# Altium schematic sheet LED_Matrix16x16.SchDoc
size A3
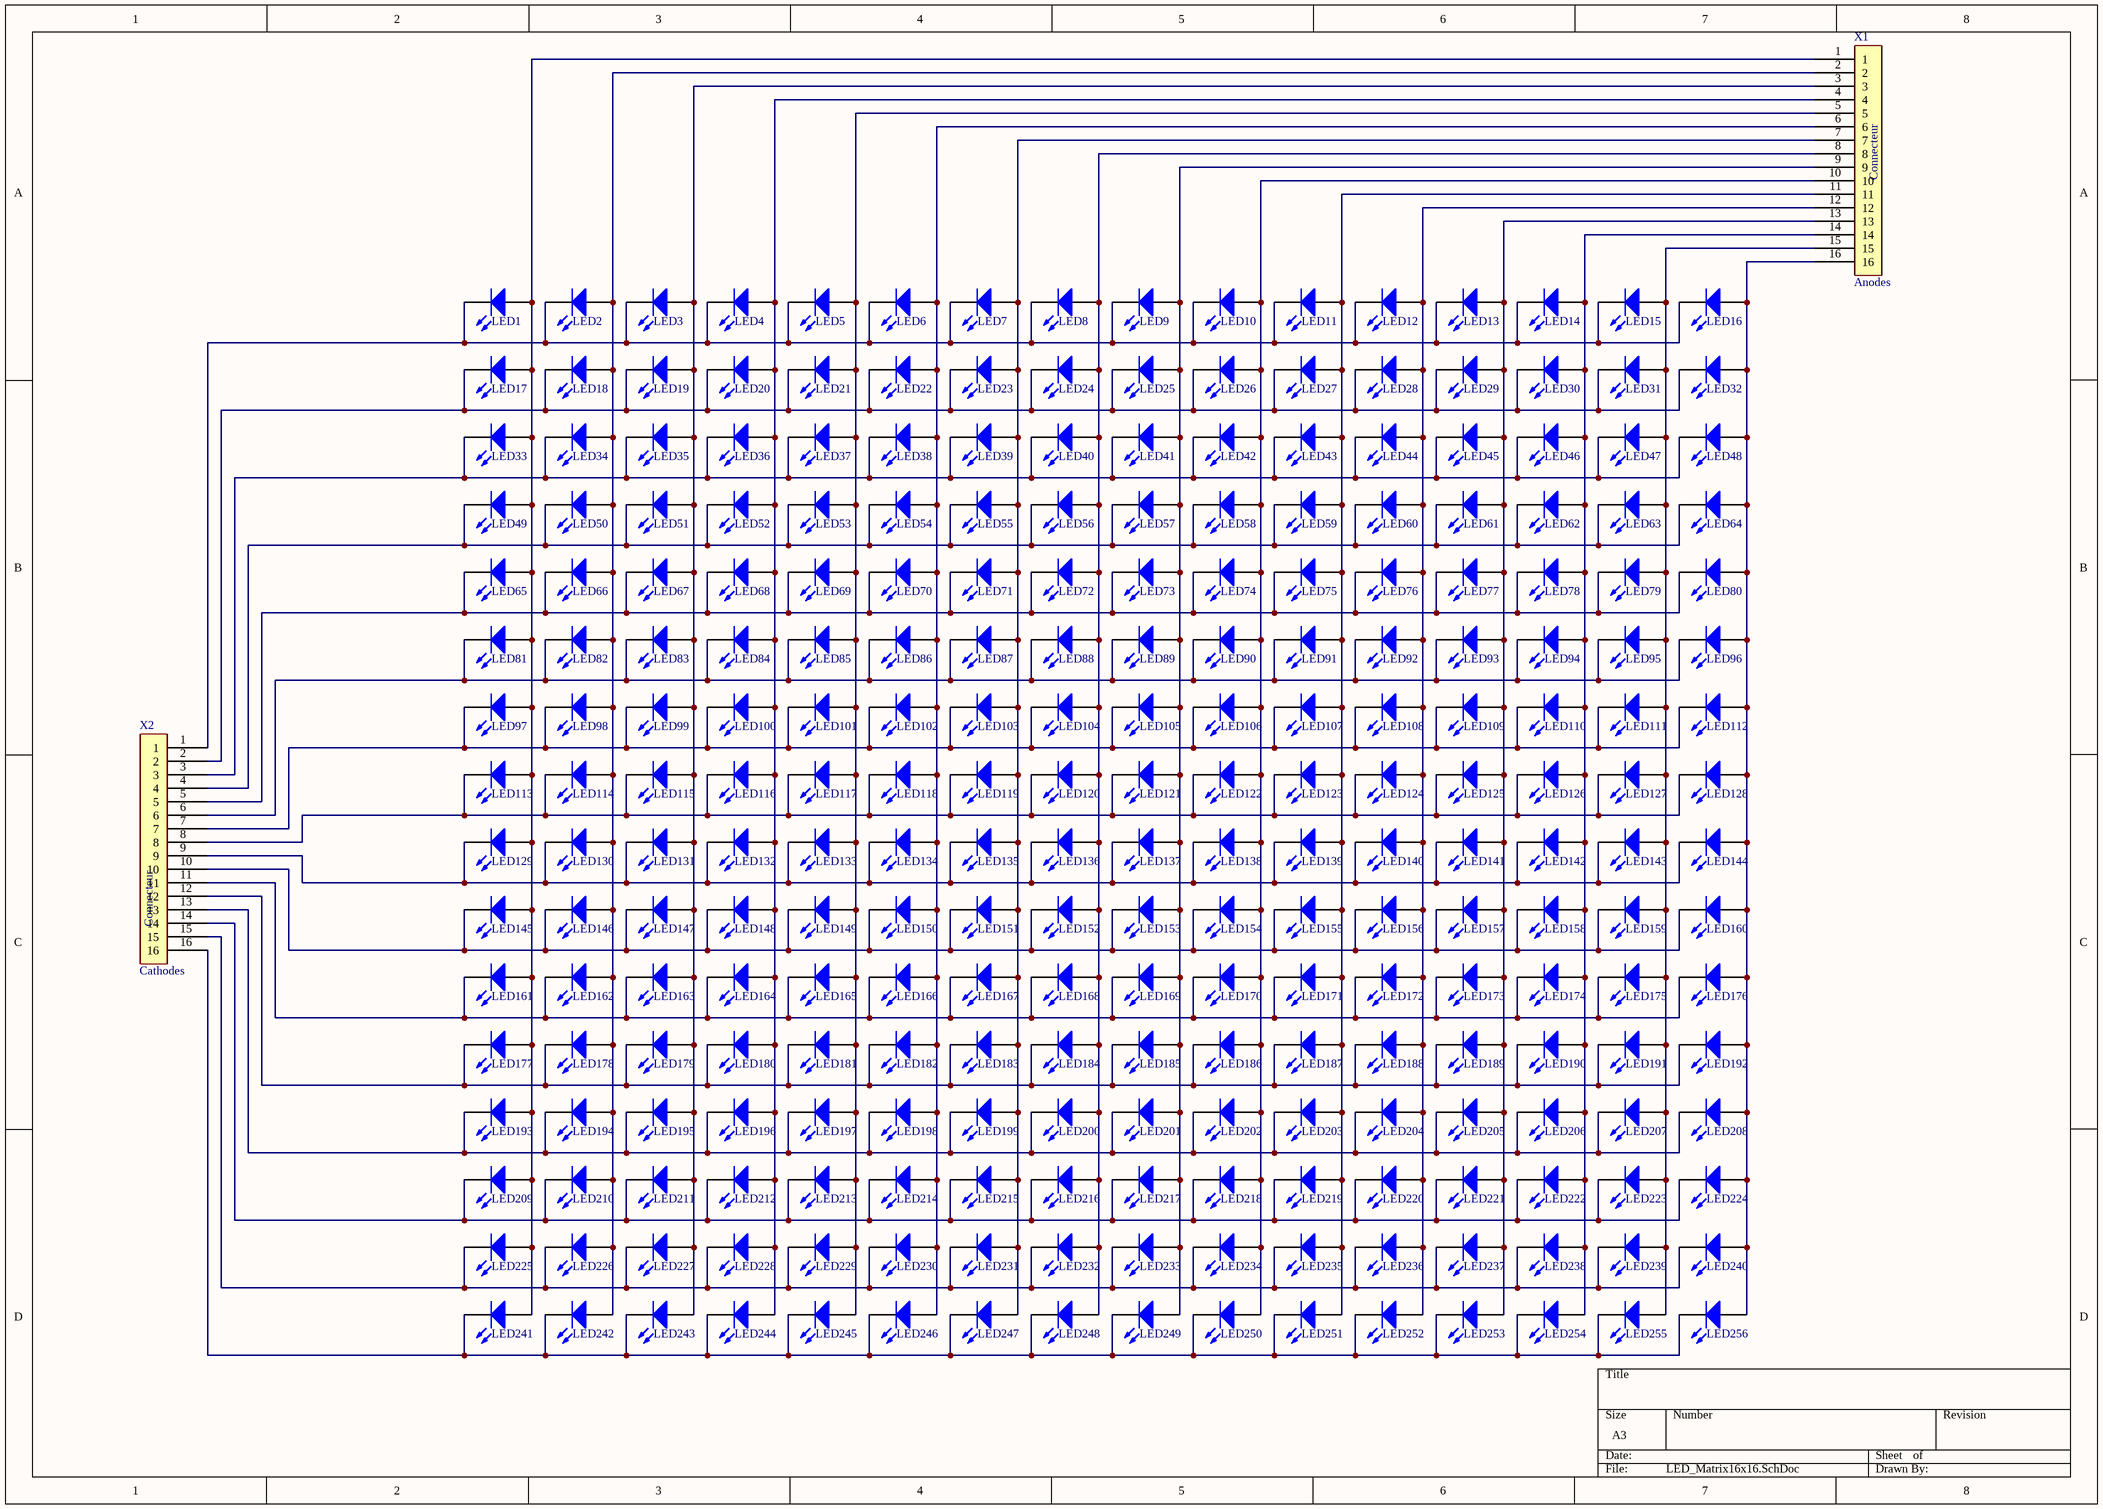
[diagram p0: LED_Matrix16x16.SchDoc]

## Parts
LED1  KPT-2012SRC-PRV  [0805_LED]  (value not drawn)
LED2  KPT-2012SRC-PRV  [0805_LED]  (value not drawn)
LED3  KPT-2012SRC-PRV  [0805_LED]  (value not drawn)
LED4  KPT-2012SRC-PRV  [0805_LED]  (value not drawn)
LED5  KPT-2012SRC-PRV  [0805_LED]  (value not drawn)
LED6  KPT-2012SRC-PRV  [0805_LED]  (value not drawn)
LED7  KPT-2012SRC-PRV  [0805_LED]  (value not drawn)
LED8  KPT-2012SRC-PRV  [0805_LED]  (value not drawn)
LED9  KPT-2012SRC-PRV  [0805_LED]  (value not drawn)
LED10  KPT-2012SRC-PRV  [0805_LED]  (value not drawn)
LED11  KPT-2012SRC-PRV  [0805_LED]  (value not drawn)
LED12  KPT-2012SRC-PRV  [0805_LED]  (value not drawn)
LED13  KPT-2012SRC-PRV  [0805_LED]  (value not drawn)
LED14  KPT-2012SRC-PRV  [0805_LED]  (value not drawn)
LED15  KPT-2012SRC-PRV  [0805_LED]  (value not drawn)
LED16  KPT-2012SRC-PRV  [0805_LED]  (value not drawn)
LED17  KPT-2012SRC-PRV  [0805_LED]  (value not drawn)
LED18  KPT-2012SRC-PRV  [0805_LED]  (value not drawn)
LED19  KPT-2012SRC-PRV  [0805_LED]  (value not drawn)
LED20  KPT-2012SRC-PRV  [0805_LED]  (value not drawn)
LED21  KPT-2012SRC-PRV  [0805_LED]  (value not drawn)
LED22  KPT-2012SRC-PRV  [0805_LED]  (value not drawn)
LED23  KPT-2012SRC-PRV  [0805_LED]  (value not drawn)
LED24  KPT-2012SRC-PRV  [0805_LED]  (value not drawn)
LED25  KPT-2012SRC-PRV  [0805_LED]  (value not drawn)
LED26  KPT-2012SRC-PRV  [0805_LED]  (value not drawn)
LED27  KPT-2012SRC-PRV  [0805_LED]  (value not drawn)
LED28  KPT-2012SRC-PRV  [0805_LED]  (value not drawn)
LED29  KPT-2012SRC-PRV  [0805_LED]  (value not drawn)
LED30  KPT-2012SRC-PRV  [0805_LED]  (value not drawn)
LED31  KPT-2012SRC-PRV  [0805_LED]  (value not drawn)
LED32  KPT-2012SRC-PRV  [0805_LED]  (value not drawn)
LED33  KPT-2012SRC-PRV  [0805_LED]  (value not drawn)
LED34  KPT-2012SRC-PRV  [0805_LED]  (value not drawn)
LED35  KPT-2012SRC-PRV  [0805_LED]  (value not drawn)
LED36  KPT-2012SRC-PRV  [0805_LED]  (value not drawn)
LED37  KPT-2012SRC-PRV  [0805_LED]  (value not drawn)
LED38  KPT-2012SRC-PRV  [0805_LED]  (value not drawn)
LED39  KPT-2012SRC-PRV  [0805_LED]  (value not drawn)
LED40  KPT-2012SRC-PRV  [0805_LED]  (value not drawn)
LED41  KPT-2012SRC-PRV  [0805_LED]  (value not drawn)
LED42  KPT-2012SRC-PRV  [0805_LED]  (value not drawn)
LED43  KPT-2012SRC-PRV  [0805_LED]  (value not drawn)
LED44  KPT-2012SRC-PRV  [0805_LED]  (value not drawn)
LED45  KPT-2012SRC-PRV  [0805_LED]  (value not drawn)
LED46  KPT-2012SRC-PRV  [0805_LED]  (value not drawn)
LED47  KPT-2012SRC-PRV  [0805_LED]  (value not drawn)
LED48  KPT-2012SRC-PRV  [0805_LED]  (value not drawn)
LED49  KPT-2012SRC-PRV  [0805_LED]  (value not drawn)
LED50  KPT-2012SRC-PRV  [0805_LED]  (value not drawn)
LED51  KPT-2012SRC-PRV  [0805_LED]  (value not drawn)
LED52  KPT-2012SRC-PRV  [0805_LED]  (value not drawn)
LED53  KPT-2012SRC-PRV  [0805_LED]  (value not drawn)
LED54  KPT-2012SRC-PRV  [0805_LED]  (value not drawn)
LED55  KPT-2012SRC-PRV  [0805_LED]  (value not drawn)
LED56  KPT-2012SRC-PRV  [0805_LED]  (value not drawn)
LED57  KPT-2012SRC-PRV  [0805_LED]  (value not drawn)
LED58  KPT-2012SRC-PRV  [0805_LED]  (value not drawn)
LED59  KPT-2012SRC-PRV  [0805_LED]  (value not drawn)
LED60  KPT-2012SRC-PRV  [0805_LED]  (value not drawn)
LED61  KPT-2012SRC-PRV  [0805_LED]  (value not drawn)
LED62  KPT-2012SRC-PRV  [0805_LED]  (value not drawn)
LED63  KPT-2012SRC-PRV  [0805_LED]  (value not drawn)
LED64  KPT-2012SRC-PRV  [0805_LED]  (value not drawn)
LED65  KPT-2012SRC-PRV  [0805_LED]  (value not drawn)
LED66  KPT-2012SRC-PRV  [0805_LED]  (value not drawn)
LED67  KPT-2012SRC-PRV  [0805_LED]  (value not drawn)
LED68  KPT-2012SRC-PRV  [0805_LED]  (value not drawn)
LED69  KPT-2012SRC-PRV  [0805_LED]  (value not drawn)
LED70  KPT-2012SRC-PRV  [0805_LED]  (value not drawn)
LED71  KPT-2012SRC-PRV  [0805_LED]  (value not drawn)
LED72  KPT-2012SRC-PRV  [0805_LED]  (value not drawn)
LED73  KPT-2012SRC-PRV  [0805_LED]  (value not drawn)
LED74  KPT-2012SRC-PRV  [0805_LED]  (value not drawn)
LED75  KPT-2012SRC-PRV  [0805_LED]  (value not drawn)
LED76  KPT-2012SRC-PRV  [0805_LED]  (value not drawn)
LED77  KPT-2012SRC-PRV  [0805_LED]  (value not drawn)
LED78  KPT-2012SRC-PRV  [0805_LED]  (value not drawn)
LED79  KPT-2012SRC-PRV  [0805_LED]  (value not drawn)
LED80  KPT-2012SRC-PRV  [0805_LED]  (value not drawn)
LED81  KPT-2012SRC-PRV  [0805_LED]  (value not drawn)
LED82  KPT-2012SRC-PRV  [0805_LED]  (value not drawn)
LED83  KPT-2012SRC-PRV  [0805_LED]  (value not drawn)
LED84  KPT-2012SRC-PRV  [0805_LED]  (value not drawn)
LED85  KPT-2012SRC-PRV  [0805_LED]  (value not drawn)
LED86  KPT-2012SRC-PRV  [0805_LED]  (value not drawn)
LED87  KPT-2012SRC-PRV  [0805_LED]  (value not drawn)
LED88  KPT-2012SRC-PRV  [0805_LED]  (value not drawn)
LED89  KPT-2012SRC-PRV  [0805_LED]  (value not drawn)
LED90  KPT-2012SRC-PRV  [0805_LED]  (value not drawn)
LED91  KPT-2012SRC-PRV  [0805_LED]  (value not drawn)
LED92  KPT-2012SRC-PRV  [0805_LED]  (value not drawn)
LED93  KPT-2012SRC-PRV  [0805_LED]  (value not drawn)
LED94  KPT-2012SRC-PRV  [0805_LED]  (value not drawn)
LED95  KPT-2012SRC-PRV  [0805_LED]  (value not drawn)
LED96  KPT-2012SRC-PRV  [0805_LED]  (value not drawn)
LED97  KPT-2012SRC-PRV  [0805_LED]  (value not drawn)
LED98  KPT-2012SRC-PRV  [0805_LED]  (value not drawn)
LED99  KPT-2012SRC-PRV  [0805_LED]  (value not drawn)
LED100  KPT-2012SRC-PRV  [0805_LED]  (value not drawn)
LED101  KPT-2012SRC-PRV  [0805_LED]  (value not drawn)
LED102  KPT-2012SRC-PRV  [0805_LED]  (value not drawn)
LED103  KPT-2012SRC-PRV  [0805_LED]  (value not drawn)
LED104  KPT-2012SRC-PRV  [0805_LED]  (value not drawn)
LED105  KPT-2012SRC-PRV  [0805_LED]  (value not drawn)
LED106  KPT-2012SRC-PRV  [0805_LED]  (value not drawn)
LED107  KPT-2012SRC-PRV  [0805_LED]  (value not drawn)
LED108  KPT-2012SRC-PRV  [0805_LED]  (value not drawn)
LED109  KPT-2012SRC-PRV  [0805_LED]  (value not drawn)
LED110  KPT-2012SRC-PRV  [0805_LED]  (value not drawn)
LED111  KPT-2012SRC-PRV  [0805_LED]  (value not drawn)
LED112  KPT-2012SRC-PRV  [0805_LED]  (value not drawn)
LED113  KPT-2012SRC-PRV  [0805_LED]  (value not drawn)
LED114  KPT-2012SRC-PRV  [0805_LED]  (value not drawn)
LED115  KPT-2012SRC-PRV  [0805_LED]  (value not drawn)
LED116  KPT-2012SRC-PRV  [0805_LED]  (value not drawn)
LED117  KPT-2012SRC-PRV  [0805_LED]  (value not drawn)
LED118  KPT-2012SRC-PRV  [0805_LED]  (value not drawn)
LED119  KPT-2012SRC-PRV  [0805_LED]  (value not drawn)
LED120  KPT-2012SRC-PRV  [0805_LED]  (value not drawn)
LED121  KPT-2012SRC-PRV  [0805_LED]  (value not drawn)
LED122  KPT-2012SRC-PRV  [0805_LED]  (value not drawn)
LED123  KPT-2012SRC-PRV  [0805_LED]  (value not drawn)
LED124  KPT-2012SRC-PRV  [0805_LED]  (value not drawn)
LED125  KPT-2012SRC-PRV  [0805_LED]  (value not drawn)
LED126  KPT-2012SRC-PRV  [0805_LED]  (value not drawn)
LED127  KPT-2012SRC-PRV  [0805_LED]  (value not drawn)
LED128  KPT-2012SRC-PRV  [0805_LED]  (value not drawn)
LED129  KPT-2012SRC-PRV  [0805_LED]  (value not drawn)
LED130  KPT-2012SRC-PRV  [0805_LED]  (value not drawn)
LED131  KPT-2012SRC-PRV  [0805_LED]  (value not drawn)
LED132  KPT-2012SRC-PRV  [0805_LED]  (value not drawn)
LED133  KPT-2012SRC-PRV  [0805_LED]  (value not drawn)
LED134  KPT-2012SRC-PRV  [0805_LED]  (value not drawn)
LED135  KPT-2012SRC-PRV  [0805_LED]  (value not drawn)
LED136  KPT-2012SRC-PRV  [0805_LED]  (value not drawn)
LED137  KPT-2012SRC-PRV  [0805_LED]  (value not drawn)
LED138  KPT-2012SRC-PRV  [0805_LED]  (value not drawn)
LED139  KPT-2012SRC-PRV  [0805_LED]  (value not drawn)
LED140  KPT-2012SRC-PRV  [0805_LED]  (value not drawn)
LED141  KPT-2012SRC-PRV  [0805_LED]  (value not drawn)
LED142  KPT-2012SRC-PRV  [0805_LED]  (value not drawn)
LED143  KPT-2012SRC-PRV  [0805_LED]  (value not drawn)
LED144  KPT-2012SRC-PRV  [0805_LED]  (value not drawn)
LED145  KPT-2012SRC-PRV  [0805_LED]  (value not drawn)
LED146  KPT-2012SRC-PRV  [0805_LED]  (value not drawn)
LED147  KPT-2012SRC-PRV  [0805_LED]  (value not drawn)
LED148  KPT-2012SRC-PRV  [0805_LED]  (value not drawn)
LED149  KPT-2012SRC-PRV  [0805_LED]  (value not drawn)
LED150  KPT-2012SRC-PRV  [0805_LED]  (value not drawn)
LED151  KPT-2012SRC-PRV  [0805_LED]  (value not drawn)
LED152  KPT-2012SRC-PRV  [0805_LED]  (value not drawn)
LED153  KPT-2012SRC-PRV  [0805_LED]  (value not drawn)
LED154  KPT-2012SRC-PRV  [0805_LED]  (value not drawn)
LED155  KPT-2012SRC-PRV  [0805_LED]  (value not drawn)
LED156  KPT-2012SRC-PRV  [0805_LED]  (value not drawn)
LED157  KPT-2012SRC-PRV  [0805_LED]  (value not drawn)
LED158  KPT-2012SRC-PRV  [0805_LED]  (value not drawn)
LED159  KPT-2012SRC-PRV  [0805_LED]  (value not drawn)
LED160  KPT-2012SRC-PRV  [0805_LED]  (value not drawn)
LED161  KPT-2012SRC-PRV  [0805_LED]  (value not drawn)
LED162  KPT-2012SRC-PRV  [0805_LED]  (value not drawn)
LED163  KPT-2012SRC-PRV  [0805_LED]  (value not drawn)
LED164  KPT-2012SRC-PRV  [0805_LED]  (value not drawn)
LED165  KPT-2012SRC-PRV  [0805_LED]  (value not drawn)
LED166  KPT-2012SRC-PRV  [0805_LED]  (value not drawn)
LED167  KPT-2012SRC-PRV  [0805_LED]  (value not drawn)
LED168  KPT-2012SRC-PRV  [0805_LED]  (value not drawn)
LED169  KPT-2012SRC-PRV  [0805_LED]  (value not drawn)
LED170  KPT-2012SRC-PRV  [0805_LED]  (value not drawn)
LED171  KPT-2012SRC-PRV  [0805_LED]  (value not drawn)
LED172  KPT-2012SRC-PRV  [0805_LED]  (value not drawn)
LED173  KPT-2012SRC-PRV  [0805_LED]  (value not drawn)
LED174  KPT-2012SRC-PRV  [0805_LED]  (value not drawn)
LED175  KPT-2012SRC-PRV  [0805_LED]  (value not drawn)
LED176  KPT-2012SRC-PRV  [0805_LED]  (value not drawn)
LED177  KPT-2012SRC-PRV  [0805_LED]  (value not drawn)
LED178  KPT-2012SRC-PRV  [0805_LED]  (value not drawn)
LED179  KPT-2012SRC-PRV  [0805_LED]  (value not drawn)
LED180  KPT-2012SRC-PRV  [0805_LED]  (value not drawn)
LED181  KPT-2012SRC-PRV  [0805_LED]  (value not drawn)
LED182  KPT-2012SRC-PRV  [0805_LED]  (value not drawn)
LED183  KPT-2012SRC-PRV  [0805_LED]  (value not drawn)
LED184  KPT-2012SRC-PRV  [0805_LED]  (value not drawn)
LED185  KPT-2012SRC-PRV  [0805_LED]  (value not drawn)
LED186  KPT-2012SRC-PRV  [0805_LED]  (value not drawn)
LED187  KPT-2012SRC-PRV  [0805_LED]  (value not drawn)
LED188  KPT-2012SRC-PRV  [0805_LED]  (value not drawn)
LED189  KPT-2012SRC-PRV  [0805_LED]  (value not drawn)
LED190  KPT-2012SRC-PRV  [0805_LED]  (value not drawn)
LED191  KPT-2012SRC-PRV  [0805_LED]  (value not drawn)
LED192  KPT-2012SRC-PRV  [0805_LED]  (value not drawn)
LED193  KPT-2012SRC-PRV  [0805_LED]  (value not drawn)
LED194  KPT-2012SRC-PRV  [0805_LED]  (value not drawn)
LED195  KPT-2012SRC-PRV  [0805_LED]  (value not drawn)
LED196  KPT-2012SRC-PRV  [0805_LED]  (value not drawn)
LED197  KPT-2012SRC-PRV  [0805_LED]  (value not drawn)
LED198  KPT-2012SRC-PRV  [0805_LED]  (value not drawn)
LED199  KPT-2012SRC-PRV  [0805_LED]  (value not drawn)
LED200  KPT-2012SRC-PRV  [0805_LED]  (value not drawn)
LED201  KPT-2012SRC-PRV  [0805_LED]  (value not drawn)
LED202  KPT-2012SRC-PRV  [0805_LED]  (value not drawn)
LED203  KPT-2012SRC-PRV  [0805_LED]  (value not drawn)
LED204  KPT-2012SRC-PRV  [0805_LED]  (value not drawn)
LED205  KPT-2012SRC-PRV  [0805_LED]  (value not drawn)
LED206  KPT-2012SRC-PRV  [0805_LED]  (value not drawn)
LED207  KPT-2012SRC-PRV  [0805_LED]  (value not drawn)
LED208  KPT-2012SRC-PRV  [0805_LED]  (value not drawn)
LED209  KPT-2012SRC-PRV  [0805_LED]  (value not drawn)
LED210  KPT-2012SRC-PRV  [0805_LED]  (value not drawn)
LED211  KPT-2012SRC-PRV  [0805_LED]  (value not drawn)
LED212  KPT-2012SRC-PRV  [0805_LED]  (value not drawn)
LED213  KPT-2012SRC-PRV  [0805_LED]  (value not drawn)
LED214  KPT-2012SRC-PRV  [0805_LED]  (value not drawn)
LED215  KPT-2012SRC-PRV  [0805_LED]  (value not drawn)
LED216  KPT-2012SRC-PRV  [0805_LED]  (value not drawn)
LED217  KPT-2012SRC-PRV  [0805_LED]  (value not drawn)
LED218  KPT-2012SRC-PRV  [0805_LED]  (value not drawn)
LED219  KPT-2012SRC-PRV  [0805_LED]  (value not drawn)
LED220  KPT-2012SRC-PRV  [0805_LED]  (value not drawn)
LED221  KPT-2012SRC-PRV  [0805_LED]  (value not drawn)
LED222  KPT-2012SRC-PRV  [0805_LED]  (value not drawn)
LED223  KPT-2012SRC-PRV  [0805_LED]  (value not drawn)
LED224  KPT-2012SRC-PRV  [0805_LED]  (value not drawn)
LED225  KPT-2012SRC-PRV  [0805_LED]  (value not drawn)
LED226  KPT-2012SRC-PRV  [0805_LED]  (value not drawn)
LED227  KPT-2012SRC-PRV  [0805_LED]  (value not drawn)
LED228  KPT-2012SRC-PRV  [0805_LED]  (value not drawn)
LED229  KPT-2012SRC-PRV  [0805_LED]  (value not drawn)
LED230  KPT-2012SRC-PRV  [0805_LED]  (value not drawn)
LED231  KPT-2012SRC-PRV  [0805_LED]  (value not drawn)
LED232  KPT-2012SRC-PRV  [0805_LED]  (value not drawn)
LED233  KPT-2012SRC-PRV  [0805_LED]  (value not drawn)
LED234  KPT-2012SRC-PRV  [0805_LED]  (value not drawn)
LED235  KPT-2012SRC-PRV  [0805_LED]  (value not drawn)
LED236  KPT-2012SRC-PRV  [0805_LED]  (value not drawn)
LED237  KPT-2012SRC-PRV  [0805_LED]  (value not drawn)
LED238  KPT-2012SRC-PRV  [0805_LED]  (value not drawn)
LED239  KPT-2012SRC-PRV  [0805_LED]  (value not drawn)
LED240  KPT-2012SRC-PRV  [0805_LED]  (value not drawn)
LED241  KPT-2012SRC-PRV  [0805_LED]  (value not drawn)
LED242  KPT-2012SRC-PRV  [0805_LED]  (value not drawn)
LED243  KPT-2012SRC-PRV  [0805_LED]  (value not drawn)
LED244  KPT-2012SRC-PRV  [0805_LED]  (value not drawn)
LED245  KPT-2012SRC-PRV  [0805_LED]  (value not drawn)
LED246  KPT-2012SRC-PRV  [0805_LED]  (value not drawn)
LED247  KPT-2012SRC-PRV  [0805_LED]  (value not drawn)
LED248  KPT-2012SRC-PRV  [0805_LED]  (value not drawn)
LED249  KPT-2012SRC-PRV  [0805_LED]  (value not drawn)
LED250  KPT-2012SRC-PRV  [0805_LED]  (value not drawn)
LED251  KPT-2012SRC-PRV  [0805_LED]  (value not drawn)
LED252  KPT-2012SRC-PRV  [0805_LED]  (value not drawn)
LED253  KPT-2012SRC-PRV  [0805_LED]  (value not drawn)
LED254  KPT-2012SRC-PRV  [0805_LED]  (value not drawn)
LED255  KPT-2012SRC-PRV  [0805_LED]  (value not drawn)
LED256  KPT-2012SRC-PRV  [0805_LED]  (value not drawn)
X1  Anodes  [CON8x8(edited)]
X2  Cathodes  [CON8x8(edited)]

## Nets
NetLED1_1: LED1.1(K) LED2.1(K) LED3.1(K) LED4.1(K) LED5.1(K) LED6.1(K) LED7.1(K) LED8.1(K) LED9.1(K) LED10.1(K) LED11.1(K) LED12.1(K) LED13.1(K) LED14.1(K) LED15.1(K) LED16.1(K) X2.1
NetLED1_2: LED1.2(A) LED17.2(A) LED33.2(A) LED49.2(A) LED65.2(A) LED81.2(A) LED97.2(A) LED113.2(A) LED129.2(A) LED145.2(A) LED161.2(A) LED177.2(A) LED193.2(A) LED209.2(A) LED225.2(A) LED241.2(A) X1.1
NetLED2_2: LED2.2(A) LED18.2(A) LED34.2(A) LED50.2(A) LED66.2(A) LED82.2(A) LED98.2(A) LED114.2(A) LED130.2(A) LED146.2(A) LED162.2(A) LED178.2(A) LED194.2(A) LED210.2(A) LED226.2(A) LED242.2(A) X1.2
NetLED3_2: LED3.2(A) LED19.2(A) LED35.2(A) LED51.2(A) LED67.2(A) LED83.2(A) LED99.2(A) LED115.2(A) LED131.2(A) LED147.2(A) LED163.2(A) LED179.2(A) LED195.2(A) LED211.2(A) LED227.2(A) LED243.2(A) X1.3
NetLED4_2: LED4.2(A) LED20.2(A) LED36.2(A) LED52.2(A) LED68.2(A) LED84.2(A) LED100.2(A) LED116.2(A) LED132.2(A) LED148.2(A) LED164.2(A) LED180.2(A) LED196.2(A) LED212.2(A) LED228.2(A) LED244.2(A) X1.4
NetLED5_2: LED5.2(A) LED21.2(A) LED37.2(A) LED53.2(A) LED69.2(A) LED85.2(A) LED101.2(A) LED117.2(A) LED133.2(A) LED149.2(A) LED165.2(A) LED181.2(A) LED197.2(A) LED213.2(A) LED229.2(A) LED245.2(A) X1.5
NetLED6_2: LED6.2(A) LED22.2(A) LED38.2(A) LED54.2(A) LED70.2(A) LED86.2(A) LED102.2(A) LED118.2(A) LED134.2(A) LED150.2(A) LED166.2(A) LED182.2(A) LED198.2(A) LED214.2(A) LED230.2(A) LED246.2(A) X1.6
NetLED7_2: LED7.2(A) LED23.2(A) LED39.2(A) LED55.2(A) LED71.2(A) LED87.2(A) LED103.2(A) LED119.2(A) LED135.2(A) LED151.2(A) LED167.2(A) LED183.2(A) LED199.2(A) LED215.2(A) LED231.2(A) LED247.2(A) X1.7
NetLED8_2: LED8.2(A) LED24.2(A) LED40.2(A) LED56.2(A) LED72.2(A) LED88.2(A) LED104.2(A) LED120.2(A) LED136.2(A) LED152.2(A) LED168.2(A) LED184.2(A) LED200.2(A) LED216.2(A) LED232.2(A) LED248.2(A) X1.8
NetLED9_2: LED9.2(A) LED25.2(A) LED41.2(A) LED57.2(A) LED73.2(A) LED89.2(A) LED105.2(A) LED121.2(A) LED137.2(A) LED153.2(A) LED169.2(A) LED185.2(A) LED201.2(A) LED217.2(A) LED233.2(A) LED249.2(A) X1.9
NetLED10_2: LED10.2(A) LED26.2(A) LED42.2(A) LED58.2(A) LED74.2(A) LED90.2(A) LED106.2(A) LED122.2(A) LED138.2(A) LED154.2(A) LED170.2(A) LED186.2(A) LED202.2(A) LED218.2(A) LED234.2(A) LED250.2(A) X1.10
NetLED11_2: LED11.2(A) LED27.2(A) LED43.2(A) LED59.2(A) LED75.2(A) LED91.2(A) LED107.2(A) LED123.2(A) LED139.2(A) LED155.2(A) LED171.2(A) LED187.2(A) LED203.2(A) LED219.2(A) LED235.2(A) LED251.2(A) X1.11
NetLED12_2: LED12.2(A) LED28.2(A) LED44.2(A) LED60.2(A) LED76.2(A) LED92.2(A) LED108.2(A) LED124.2(A) LED140.2(A) LED156.2(A) LED172.2(A) LED188.2(A) LED204.2(A) LED220.2(A) LED236.2(A) LED252.2(A) X1.12
NetLED13_2: LED13.2(A) LED29.2(A) LED45.2(A) LED61.2(A) LED77.2(A) LED93.2(A) LED109.2(A) LED125.2(A) LED141.2(A) LED157.2(A) LED173.2(A) LED189.2(A) LED205.2(A) LED221.2(A) LED237.2(A) LED253.2(A) X1.13
NetLED14_2: LED14.2(A) LED30.2(A) LED46.2(A) LED62.2(A) LED78.2(A) LED94.2(A) LED110.2(A) LED126.2(A) LED142.2(A) LED158.2(A) LED174.2(A) LED190.2(A) LED206.2(A) LED222.2(A) LED238.2(A) LED254.2(A) X1.14
NetLED15_2: LED15.2(A) LED31.2(A) LED47.2(A) LED63.2(A) LED79.2(A) LED95.2(A) LED111.2(A) LED127.2(A) LED143.2(A) LED159.2(A) LED175.2(A) LED191.2(A) LED207.2(A) LED223.2(A) LED239.2(A) LED255.2(A) X1.15
NetLED16_2: LED16.2(A) LED32.2(A) LED48.2(A) LED64.2(A) LED80.2(A) LED96.2(A) LED112.2(A) LED128.2(A) LED144.2(A) LED160.2(A) LED176.2(A) LED192.2(A) LED208.2(A) LED224.2(A) LED240.2(A) LED256.2(A) X1.16
NetLED17_1: LED17.1(K) LED18.1(K) LED19.1(K) LED20.1(K) LED21.1(K) LED22.1(K) LED23.1(K) LED24.1(K) LED25.1(K) LED26.1(K) LED27.1(K) LED28.1(K) LED29.1(K) LED30.1(K) LED31.1(K) LED32.1(K) X2.2
NetLED33_1: LED33.1(K) LED34.1(K) LED35.1(K) LED36.1(K) LED37.1(K) LED38.1(K) LED39.1(K) LED40.1(K) LED41.1(K) LED42.1(K) LED43.1(K) LED44.1(K) LED45.1(K) LED46.1(K) LED47.1(K) LED48.1(K) X2.3
NetLED49_1: LED49.1(K) LED50.1(K) LED51.1(K) LED52.1(K) LED53.1(K) LED54.1(K) LED55.1(K) LED56.1(K) LED57.1(K) LED58.1(K) LED59.1(K) LED60.1(K) LED61.1(K) LED62.1(K) LED63.1(K) LED64.1(K) X2.4
NetLED65_1: LED65.1(K) LED66.1(K) LED67.1(K) LED68.1(K) LED69.1(K) LED70.1(K) LED71.1(K) LED72.1(K) LED73.1(K) LED74.1(K) LED75.1(K) LED76.1(K) LED77.1(K) LED78.1(K) LED79.1(K) LED80.1(K) X2.5
NetLED81_1: LED81.1(K) LED82.1(K) LED83.1(K) LED84.1(K) LED85.1(K) LED86.1(K) LED87.1(K) LED88.1(K) LED89.1(K) LED90.1(K) LED91.1(K) LED92.1(K) LED93.1(K) LED94.1(K) LED95.1(K) LED96.1(K) X2.6
NetLED97_1: LED97.1(K) LED98.1(K) LED99.1(K) LED100.1(K) LED101.1(K) LED102.1(K) LED103.1(K) LED104.1(K) LED105.1(K) LED106.1(K) LED107.1(K) LED108.1(K) LED109.1(K) LED110.1(K) LED111.1(K) LED112.1(K) X2.7
NetLED113_1: LED113.1(K) LED114.1(K) LED115.1(K) LED116.1(K) LED117.1(K) LED118.1(K) LED119.1(K) LED120.1(K) LED121.1(K) LED122.1(K) LED123.1(K) LED124.1(K) LED125.1(K) LED126.1(K) LED127.1(K) LED128.1(K) X2.8
NetLED129_1: LED129.1(K) LED130.1(K) LED131.1(K) LED132.1(K) LED133.1(K) LED134.1(K) LED135.1(K) LED136.1(K) LED137.1(K) LED138.1(K) LED139.1(K) LED140.1(K) LED141.1(K) LED142.1(K) LED143.1(K) LED144.1(K) X2.9
NetLED145_1: LED145.1(K) LED146.1(K) LED147.1(K) LED148.1(K) LED149.1(K) LED150.1(K) LED151.1(K) LED152.1(K) LED153.1(K) LED154.1(K) LED155.1(K) LED156.1(K) LED157.1(K) LED158.1(K) LED159.1(K) LED160.1(K) X2.10
NetLED161_1: LED161.1(K) LED162.1(K) LED163.1(K) LED164.1(K) LED165.1(K) LED166.1(K) LED167.1(K) LED168.1(K) LED169.1(K) LED170.1(K) LED171.1(K) LED172.1(K) LED173.1(K) LED174.1(K) LED175.1(K) LED176.1(K) X2.11
NetLED177_1: LED177.1(K) LED178.1(K) LED179.1(K) LED180.1(K) LED181.1(K) LED182.1(K) LED183.1(K) LED184.1(K) LED185.1(K) LED186.1(K) LED187.1(K) LED188.1(K) LED189.1(K) LED190.1(K) LED191.1(K) LED192.1(K) X2.12
NetLED193_1: LED193.1(K) LED194.1(K) LED195.1(K) LED196.1(K) LED197.1(K) LED198.1(K) LED199.1(K) LED200.1(K) LED201.1(K) LED202.1(K) LED203.1(K) LED204.1(K) LED205.1(K) LED206.1(K) LED207.1(K) LED208.1(K) X2.13
NetLED209_1: LED209.1(K) LED210.1(K) LED211.1(K) LED212.1(K) LED213.1(K) LED214.1(K) LED215.1(K) LED216.1(K) LED217.1(K) LED218.1(K) LED219.1(K) LED220.1(K) LED221.1(K) LED222.1(K) LED223.1(K) LED224.1(K) X2.14
NetLED225_1: LED225.1(K) LED226.1(K) LED227.1(K) LED228.1(K) LED229.1(K) LED230.1(K) LED231.1(K) LED232.1(K) LED233.1(K) LED234.1(K) LED235.1(K) LED236.1(K) LED237.1(K) LED238.1(K) LED239.1(K) LED240.1(K) X2.15
NetLED241_1: LED241.1(K) LED242.1(K) LED243.1(K) LED244.1(K) LED245.1(K) LED246.1(K) LED247.1(K) LED248.1(K) LED249.1(K) LED250.1(K) LED251.1(K) LED252.1(K) LED253.1(K) LED254.1(K) LED255.1(K) LED256.1(K) X2.16

## Notes on the sheet
- (in symbol Mâle DIN 8 x 8) Connecteur

## Library data of the parts
X1 X2 = Mâle DIN 8 x 8